# Altium schematic sheet UCPD_lamp.SchDoc
size A4; DocumentNumber: 1; SheetNumber: 1; SheetTotal: 1
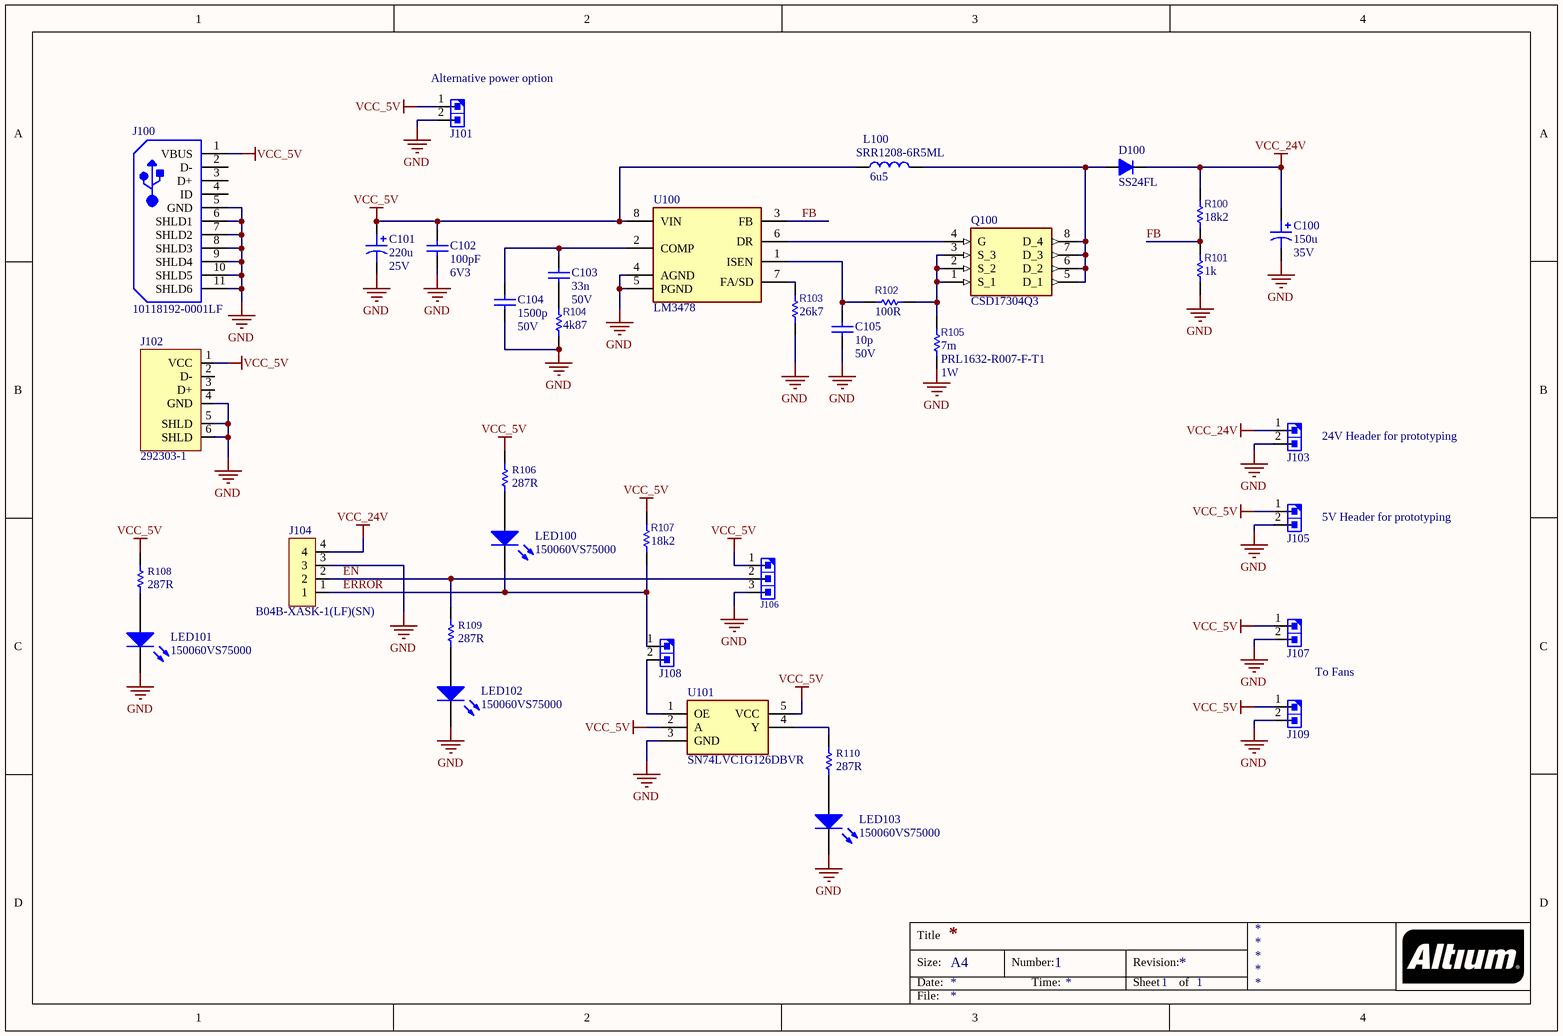
[diagram p0: UCPD_lamp.SchDoc]

## Parts
C100  value 150u  Voltage: 35V  [CAPAE1030X1050N]  (hidden comment: EEH-ZA1V151P)
C101  value 220u  Voltage: 25V  [CAPAE1030X1050N]  (hidden comment: UUD1E221MNL1GS)
C102  value 100pF  Voltage: 6V3  [CAPC1005X06N]  (hidden comment: GRM155R70J104KA01D)
C103  value 33n  Voltage: 50V  [CAPC2012X14N]  (hidden comment: CGA4J2C0G1H333J125AA)
C104  value 1500p  Voltage: 50V  [CAPC2012X14N]  (hidden comment: C2012C0G1H152J060AA)
C105  value 10p  Voltage: 50V  [CAPC2012X14N]  (hidden comment: 08055A100JAT2A)
D100  SS24FL  [SOD-123FL]
J100  10118192-0001LF  [10118192-0001LF]
J101  PRPC002SAAN-RC  [HDR_1x2_0.100"]  (value not drawn)
J102  292303-1  [292303-1]
J103  PRPC002SAAN-RC  [HDR_1x2_0.100"]  (value not drawn)
J104  B04B-XASK-1(LF)(SN)  [B04B-XASK-1(LF)(SN)]
J105  PRPC002SAAN-RC  [HDR_1x2_0.100"]  (value not drawn)
J106  PRPC003SAAN-RC  [HDR 3x1 0.100"]  (value not drawn)
J107  PRPC002SAAN-RC  [HDR_1x2_0.100"]  (value not drawn)
J108  PRPC002SAAN-RC  [HDR_1x2_0.100"]  (value not drawn)
J109  PRPC002SAAN-RC  [HDR_1x2_0.100"]  (value not drawn)
L100  value 6u5  [INDPM127127X850N]  (hidden comment: SRR1208-6R5ML)
LED100  150060VS75000  [0603_A]
LED101  150060VS75000  [0603_A]
LED102  150060VS75000  [0603_A]
LED103  150060VS75000  [0603_A]
Q100  CSD17304Q3  [DQG_VSON-CLIP]
R100  value 18k2  [RESC1005X03N]  (hidden comment: CRCW040218K2FKED)
R101  value 1k  [RESC1005X03N]  (hidden comment: CRCW04021K00FKEDC)
R102  value 100R  [RESC1005X03N]  (hidden comment: CRCW0402100RFKEDC)
R103  value 26k7  [RESC1005X03N]  (hidden comment: CRCW040226K7FKED)
R104  value 4k87  [RESC1005X03N]  (hidden comment: CRCW04024K87FKED)
R105  value 7m  Power: 1W  [RESC1632X60N]  (hidden comment: PRL1632-R007-F-T1)
R106  value 287R  [RESC1005X03N]  (hidden comment: RES: GENERAL)
R107  value 18k2  [RESC1005X03N]  (hidden comment: CRCW040218K2FKED)
R108  value 287R  [RESC1005X03N]  (hidden comment: RES: GENERAL)
R109  value 287R  [RESC1005X03N]  (hidden comment: RES: GENERAL)
R110  value 287R  [RESC1005X03N]  (hidden comment: RES: GENERAL)
U100  LM3478  [SOIC127P600X175-8N]
U101  SN74LVC1G126DBVR  [SOT95P280X145-5N]

## Nets
GND: C100.2 C101.2 C102.1 C104.1 C105.1 J100.5(GND) J100.6(SHLD1) J100.7(SHLD2) J100.8(SHLD3) J100.9(SHLD4) J100.10(SHLD5) J100.11(SHLD6) J101.2 J102.4(GND) J102.5(SHLD) J102.6(SHLD) J103.2 J104.3 J105.2 J106.3 J107.2 J109.2 LED101.1(K) LED102.1(K) LED103.1(K) R101.1 R103.1 R104.1 R105.1 U100.4(AGND) U100.5(PGND) U101.3(GND)
VCC_5V: C101.1 C102.2 J100.1(VBUS) J101.1 J102.1(VCC) J105.1 J106.1 J107.1 J109.1 L100.1 R106.2 R107.2 R108.2 U100.8(VIN) U101.2(A) U101.5(VCC)
VCC_24V: C100.1 D100.2(K) J103.1 J104.4 R100.2
EN: J104.2 J106.2 R109.2
ERROR: J104.1 J108.1 LED100.1(K) R107.1
FB: R100.1 R101.2 U100.3(FB)
NetC103_1: C103.1 R104.2
NetC103_2: C103.2 C104.2 U100.2(COMP)
NetC105_2: C105.2 R102.1 U100.1(ISEN)
NetD100_1: D100.1(A) L100.2 Q100.5(D_1) Q100.6(D_2) Q100.7(D_3) Q100.8(D_4)
NetJ108_2: J108.2 U101.1(OE)
NetLED100_2: LED100.2(A) R106.1
NetLED101_2: LED101.2(A) R108.1
NetLED102_2: LED102.2(A) R109.1
NetLED103_2: LED103.2(A) R110.1
NetQ100_1: Q100.1(S_1) Q100.2(S_2) Q100.3(S_3) R102.2 R105.2
NetQ100_4: Q100.4(G) U100.6(DR)
NetR103_2: R103.2 U100.7(FA/SD)
NetR110_2: R110.2 U101.4(Y)

Not connected (* = marked no-connect by the designer): J100 2(D-) 3(D+) 4(ID); J102 2(D-) 3(D+)

## Notes on the sheet
- (near J101) Alternative power option
- (near J103) 24V Header for prototyping
- (near J105) 5V Header for prototyping
- To Fans
- Title
- Size:
- Date:
- A4
- Number:
- Time:
- Revision:
- Sheet
- of
- File:

## Library data of the parts
C100 = EEH-ZA1V151P: CAP ALUM POLY HYB 150UF 35V SMD; Manufacturer: Panasonic; Accuracy: 20%; Type: Aluminum; Manufacturer Part Number: EEH-ZA1V151P; Supplier Part Number 1: P15450CT-ND; Package: Radial, Can - SMD; Supplier 1: Digi-Key
C101 = UUD1E221MNL1GS: CAP ALUM 220UF 20% 25V SMD; Manufacturer: Nichicon; Type: Aluminum; Manufacturer Part Number: UUD1E221MNL1GS; Supplier Part Number 1: 493-2278-1-ND; Accuracy: 20%; Package: Radial, Can - SMD; Supplier 1: Digi-Key
C102 = GRM155R70J104KA01D: CAP CER 0.1UF 6.3V X7R 0402; Manufacturer: Murata; Manufacturer Part Number: GRM155R70J104KA01D; Supplier Part Number 1: 490-6319-1-ND; Accuracy: *; Type: *; Package: 0402(1005m); Supplier 1: Digi-Key
C103 = CGA4J2C0G1H333J125AA: CAP CER 0.033UF 50V C0G 0805; Manufacturer: TDK; Accuracy: 5%; Manufacturer Part Number: CGA4J2C0G1H333J125AA; Supplier Part Number 1: 445-6950-1-ND; Type: *; Package: 0805(2012m); Supplier 1: Digi-Key
C104 = C2012C0G1H152J060AA: CAP CER 1500PF 50V C0G 0805; Manufacturer: TDK; Accuracy: 5%; Manufacturer Part Number: C2012C0G1H152J060AA; Supplier Part Number 1: 445-1331-1-ND; Type: *; Package: 0805(2012m); Supplier 1: Digi-Key
C105 = 08055A100JAT2A: CAP CER 10PF 50V C0G/NP0 0805; Manufacturer: AVX; Accuracy: 5%; Manufacturer Part Number: 08055A100JAT2A; Supplier Part Number 1: 478-1304-1-ND; Type: *; Package: 0805(2012m); Supplier 1: Digi-Key
D100 = SS24FL: DIODE SCHOTTKY 40V 2A SOD123F; Manufacturer: ON Semiconductor; Manufacturer Part Number: SS24FL; Supplier 1: Digi-Key; Supplier Part Number 1: SS24FLCT-ND
J100 = 10118192-0001LF: CONN Micro USB B Type Receptacle; Manufacturer: FCI; Current Rating: 1.8A; Number of Contacts: 5Contact; Mounting Angle: Right; Insulation Resistance: 1000MOhms; Connector Type: MicroUSBTypeBreceptacle; Gender: Female; Packaging: Reel; Termination Style: SMD/SMT; Product Category: USBConnectors; RoHS: Details; Flammability Rating: UL94V-0; Standard: USB2.0; Brand: FCI; Manufacturer URL: http://www.fci.com/; Product: MicroUSBTypeBConnectors; Operating Temperature Range: -55Cto+85C; Datasheet Version: Rev. B, 05/2015; Contact Material: CopperAlloy; Contact Plating: Gold; Datasheet URL: http://www.mouser.com/ds/2/154/10118192-793027.pdf; Color: Black; Factory Pack Quantity: 1400; Manufacturer Part Number: 10118192-0001LF; Supplier 1: Digi-Key; Supplier Part Number 1: 609-4613-1-ND
J101 J103 J105 J107-J109 = PRPC002SAAN-RC: CONN HEADER VERT 2POS 2.54MM; Manufacturer: Sullins; Pitch: 0.100"; Properties: 1x2; Supplier Part Number 1: S1011EC-02-ND; Supplier 1: Digi-Key; Manufacturer Part Number: PRPC002SAAN-RC; Package: T/H
J102 = 292303-1: CONN USB2.0 TYPEA 4POS R/A; Manufacturer: TE Connectivity; Manufacturer Part Number: 292303-1; Supplier 1: Digi-Key; Supplier Part Number 1: A31726-ND
J104 = B04B-XASK-1(LF)(SN): CONN HEADER VERT 4POS 2.5MM; Manufacturer: JST; Manufacturer Part Number: B04B-XASK-1(LF)(SN); Supplier 1: Digi-Key; Supplier Part Number 1: 455-1994-ND
J106 = PRPC003SAAN-RC: CONN HEADER VERT 3POS 2.54MM; Manufacturer: Sullins; Supplier Part Number 1: S1011EC-03-ND; Manufacturer Part Number: PRPC003SAAN-RC; Supplier 1: Digi-Key
L100 = SRR1208-6R5ML: FIXED IND 6.5UH 6A 18 MOHM SMD; Manufacturer: Bourns; Manufacturer Part Number: SRR1208-6R5ML; Supplier Part Number 1: SRR1208-6R5MLCT-ND; Footprint/Package: *; Placement: *; Properties: *; Supplier 1: Digi-Key
LED100-LED103 = CMP-1426-00006-1: SMD mono-color Chip LED, WL-SMCW, Bright Green; Manufacturer: Wuerth Elektronik; ComponentLink2URL: http://katalog.we-online.com/led/datasheet/150060VS75000.pdf; ComponentLink1Description: Manufacturer URL; PackageReference: 0603_A; Manufacturer Part Number: 150060VS75000; ComponentLink2Description: Datasheet; ComponentLink1URL: http://www.we-online.com; Color: Bright Green; Distributor Part Number: 732-4980-1-ND; Distributor: Digi-Key; Supplier 1: Digi-Key; Supplier Part Number 1: 732-4980-1-ND
Q100 = CSD17304Q3: MOSFET (N-Channel); Manufacturer_Name: Texas Instruments; Datasheet Link: http://www.ti.com/lit/gpn/csd17304q3; Manufacturer_Part_Number: CSD17304Q3; Mouser Part Number: 595-CSD17304Q3; Mouser Price/Stock: https://www.mouser.com/Search/Refine.aspx?Keyword=595-CSD17304Q3
R100 R107 = CRCW040218K2FKED: RES SMD 18.2K OHM 1% 1/16W 0402; Manufacturer: Vishay Dale; Power: 0.063W; Accuracy: 1%; Manufacturer Part Number: CRCW040218K2FKED; Supplier Part Number 1: 541-18.2KLCT-ND; Type: *; Supplier 1: Digi-Key; Package: 0402
R101 = CRCW04021K00FKEDC: RES SMD 1K OHM 1% 1/16W 0402; Manufacturer: Vishay Dale; Power: 0.063W; Accuracy: 1%; Manufacturer Part Number: CRCW04021K00FKEDC; Supplier Part Number 1: 541-3961-1-ND; Type: *; Supplier 1: Digi-Key; Package: 0402
R102 = CRCW0402100RFKEDC: RES SMD 100 OHM 1% 1/16W 0402; Manufacturer: Vishay Dale; Power: 0.63W; Accuracy: 1%; Manufacturer Part Number: CRCW0402100RFKEDC; Supplier Part Number 1: 541-3962-1-ND; Type: *; Supplier 1: Digi-Key; Package: 0402
R103 = CRCW040226K7FKED: RES SMD 26.7K OHM 1% 1/16W 0402; Manufacturer: Vishay Dale; Power: .063W; Accuracy: 1%; Manufacturer Part Number: CRCW040226K7FKED; Supplier Part Number 1: 541-26.7KLCT-ND; Type: *; Supplier 1: Digi-Key; Package: 0402
R104 = CRCW04024K87FKED: RES SMD 4.87K OHM 1% 1/16W 0402; Manufacturer: Vishay Dale; Power: .063W; Accuracy: 1%; Manufacturer Part Number: CRCW04024K87FKED; Supplier Part Number 1: 541-4.87KLCT-ND; Type: *; Supplier 1: Digi-Key; Package: 0402
R105 = PRL1632-R007-F-T1: RES 0.007 OHM 1W 1206 WIDE; Manufacturer: Susumu; Accuracy: 1%; Manufacturer Part Number: PRL1632-R007-F-T1; Supplier Part Number 1: PRL1632.007FCT-ND; Type: *; Supplier 1: Digi-Key; Package: 1206(3216m)
R106 R108-R110 = RES: GENERAL: Manufacturer: Yageo; Manufacturer Part Number: YAG3089CT-ND; Accuracy: *; Supplier Part Number 1: RC0402FR-07287RL; Power: *; Type: *; Supplier 1: Digi-Key; Package: *
U100 = LM3478: IC REG CTRLR MULT TOPOLOGY 8SOIC; Manufacturer: Texas Instruments; Manufacturer Part Number: LM3478MAX/NOPB; Datasheet Link: http://www.ti.com/lit/gpn/lm3478; Height: 1.75mm; Mouser Part Number: 926-LM3478MA/NOPB; Mouser Price/Stock: https://www.mouser.co.uk/ProductDetail/Texas-Instruments/LM3478MA-NOPB?qs=8BDZloOR%252BZH9CVb1MduuNw%3D%3D; RS Part Number: 8115560P; RS Price/Stock: http://uk.rs-online.com/web/p/products/8115560P; Supplier 1: Digi-Key; Supplier Part Number 1: 296-38111-1-ND
U101 = SN74LVC1G126DBVR: IC BUF NON-INVERT 5.5V SOT23-5; Manufacturer: Texas Instruments; Datasheet Link: http://www.ti.com/lit/ds/symlink/sn74lvc1g126.pdf; Height: 1.45mm; Manufacturer Part Number: SN74LVC1G126DBVR; Mouser Part Number: 595-SN74LVC1G126DBVR; Mouser Price/Stock: https://www.mouser.com/Search/Refine.aspx?Keyword=595-SN74LVC1G126DBVR; RS Part Number: 7968240P; RS Price/Stock: http://uk.rs-online.com/web/p/products/7968240P; Supplier 1: Digi-Key; Supplier Part Number 1: 296-11605-1-ND